# EAGLE design tick-ref-gps (EAGLE 6.2)
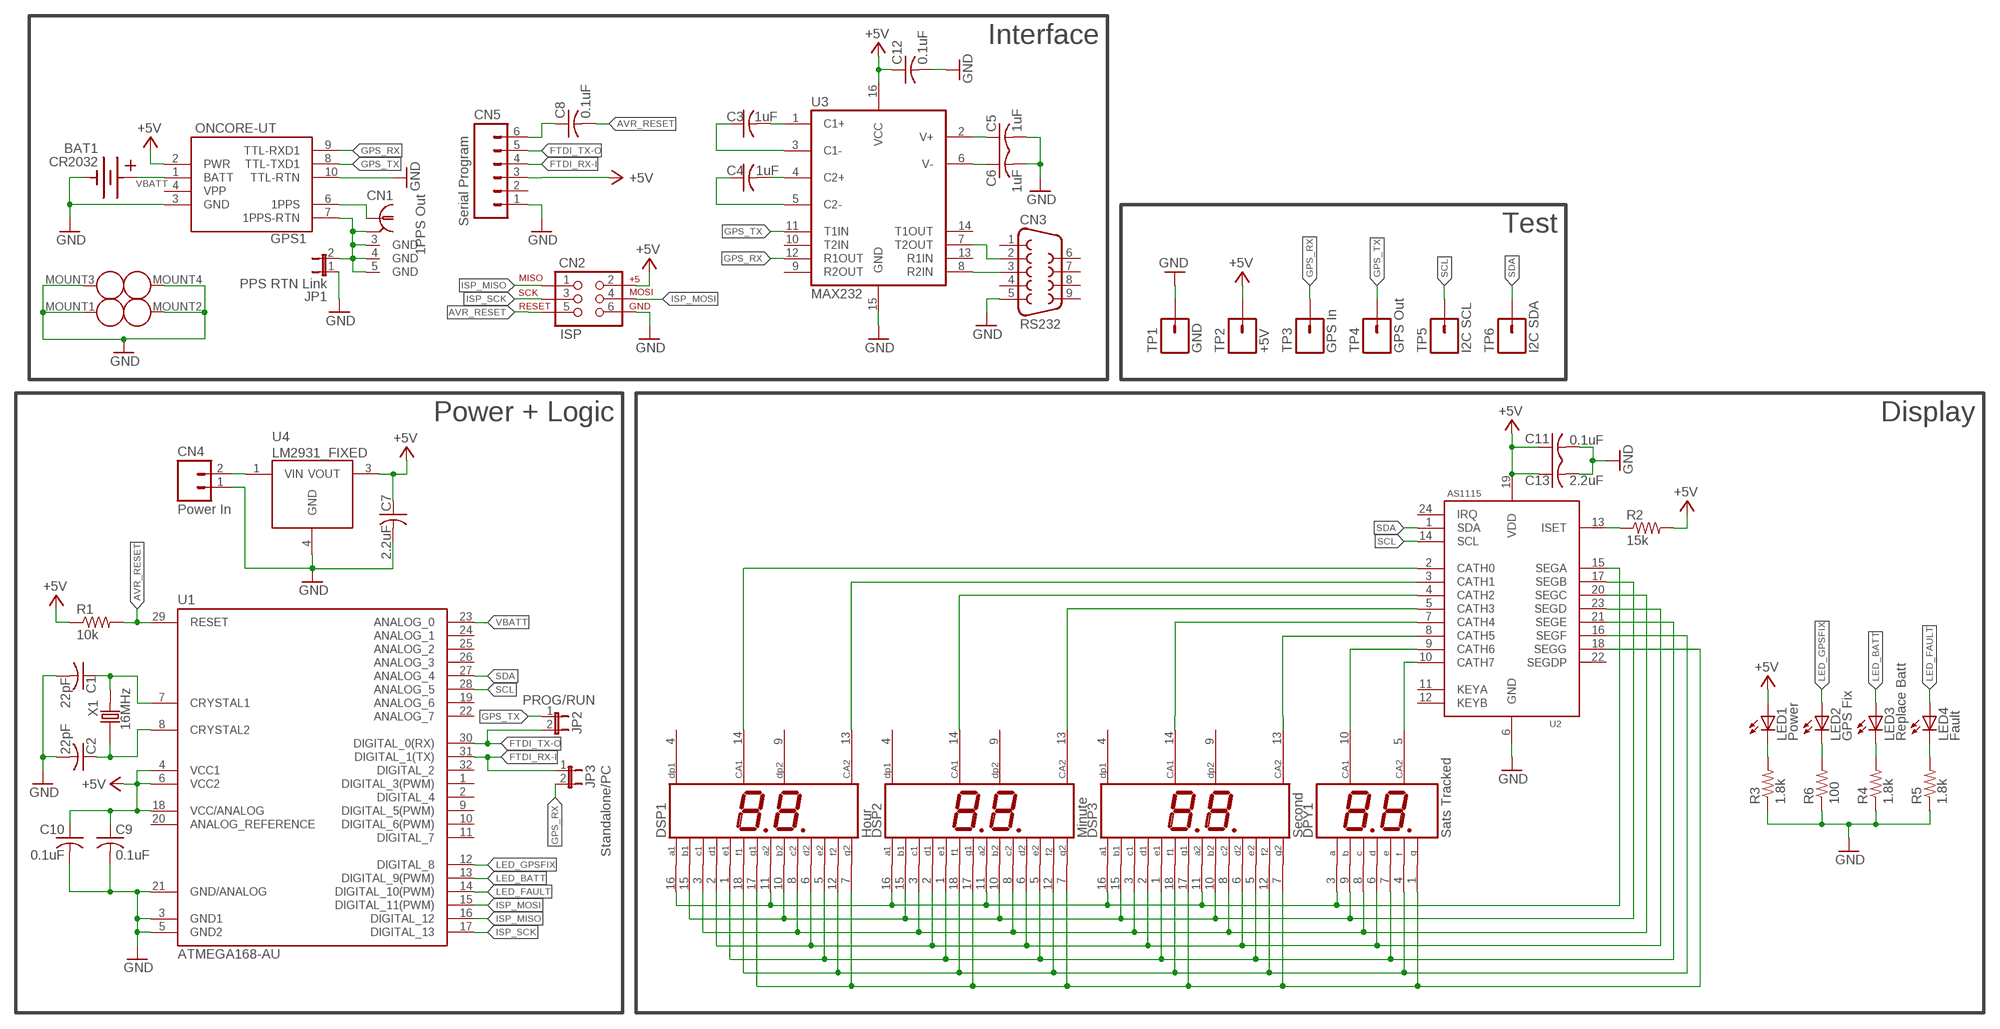
[diagram p0: schematic, sheet 1]

## Parts
BAT1  CR2032  [BK-912-CR2032]
C1  22pF  C-USC0603  [C0603]
C2  22pF  C-USC0603  [C0603]
C3  1uF  C-USC0603  [C0603]
C4  1uF  C-USC0603  [C0603]
C5  1uF  C-USC0603  [C0603]
C6  1uF  C-USC0603  [C0603]
C7  2.2uF  C-USC0805  [C0805]
C8  0.1uF  C-USC0603  [C0603]
C9  0.1uF  C-USC0603  [C0603]
C10  0.1uF  C-USC0603  [C0603]
C11  0.1uF  C-USC0603  [C0603]
C12  0.1uF  C-USC0603  [C0603]
C13  2.2uF  C-USC0805  [C0805]
CN1  1PPS Out  B35N57  [B35N57]
CN2  ISP  AVR_SPI_PRG_62X3_LOCK  [2X3_LOCK]
CN3  RS232  F09VP  [F09VP]
CN4  Power In  M02POLAR_LOCK  [MOLEX-1X2_LOCK]
CN5  Serial Program  M06LOCK  [1X06_LOCK]
DPY1  Sats Tracked  LUMEX-LDD-F302NI  [LDD-F302NI]
DSP1  Hour  HD-K121  [HDSP-R]
DSP2  Minute  HD-K121  [HDSP-R]
DSP3  Second  HD-K121  [HDSP-R]
GPS1  ONCORE-UT  [ONCORE-UT]
JP1  PPS RTN Link  JUMPER-2SMD-NO  [SJ_2S-NO]
JP2  PROG/RUN  JUMPER-2PTH_LOCK  [1X02_LOCK]
JP3  Standalone/PC  JUMPER-2SMD-NO  [SJ_2S-NO]
LED1  Power  LED5MM  [LED5MM]
LED2  GPS Fix  LED5MM  [LED5MM]
LED3  Replace Batt  LED5MM  [LED5MM]
LED4  Fault  LED5MM  [LED5MM]
R1  10k  R-US_R0603  [R0603]
R2  15k  R-US_R0603  [R0603]
R3  1.8k  R-US_R0603  [R0603]
R4  1.8k  R-US_R0603  [R0603]
R5  1.8k  R-US_R0603  [R0603]
R6  100  R-US_R0603  [R0603]
TP1  GND  M01PTH  [1X01]
TP2  +5V  M01PTH  [1X01]
TP3  GPS In  M01PTH  [1X01]
TP4  GPS Out  M01PTH  [1X01]
TP5  I2C SCL  M01PTH  [1X01]
TP6  I2C SDA  M01PTH  [1X01]
U1  ATMEGA168-AU  [TQFP32-08]
U2  AS1115  [QSOP24]
U3  MAX232  MAX232SOIC16  [SO016]
U4  LM2931_FIXED  [DPAK]
X1  16MHz  NX5032GA  [NX5032GA]

## Nets
1PPS: CN1.1 GPS1.6(1PPS)
1PPS_RTN: CN1.2(GND) CN1.3(GND) CN1.4(GND) CN1.5(GND) GPS1.7(1PPS-RTN) JP1.2
+5V: C7.1 C9.1 C10.1 C11.1 C12.1 C13.1 CN2.2 CN5.3 GPS1.2(PWR) LED1.A R1.1 R2.2 TP2.1 U1.4(VCC1) U1.6(VCC2) U1.18(VCC/ANALOG) U2.19(VDD) U3.16(VCC) U4.3(VOUT)
AVR_RESET: C8.2 CN2.5 R1.2 U1.29(RESET)
CATH_HOUR_LS: DSP1.13(CA2) U2.3(CATH1)
CATH_HOUR_MS: DSP1.14(CA1) U2.2(CATH0)
CATH_MIN_LS: DSP2.13(CA2) U2.5(CATH3)
CATH_MIN_MS: DSP2.14(CA1) U2.4(CATH2)
CATH_SATS_LS: DPY1.5(CA2) U2.10(CATH7)
CATH_SATS_MS: DPY1.10(CA1) U2.9(CATH6)
CATH_SEC_LS: DSP3.13(CA2) U2.8(CATH5)
CATH_SEC_MS: DSP3.14(CA1) U2.7(CATH4)
FTDI_RTS: C8.1 CN5.6
FTDI_RX-I: CN5.4 JP3.1 U1.31(DIGITAL_1(TX))
FTDI_TX-O: CN5.5 JP2.2 U1.30(DIGITAL_0(RX))
GND: BAT1.-(-1) C1.2 C2.2 C5.2 C6.2 C7.2 C9.2 C10.2 C11.2 C12.2 C13.2 CN2.6 CN3.5 CN4.1 CN5.1 GPS1.3(GND) GPS1.10(TTL-RTN) GPS1.MOUNT1(MOUNTHOLE1) GPS1.MOUNT2(MOUNTHOLE2) GPS1.MOUNT3(MOUNTHOLE3) GPS1.MOUNT4(MOUNTHOLE4) JP1.1 R3.1 R4.1 R5.1 R6.1 TP1.1 U1.3(GND1) U1.5(GND2) U1.21(GND/ANALOG) U2.6(GND) U3.15(GND) U4.4(GND)
GPS_RX: GPS1.9(TTL-RXD1) JP3.2 TP3.1 U3.12(R1OUT)
GPS_RX_HV: CN3.3 U3.8(R2IN)
GPS_TX: GPS1.8(TTL-TXD1) JP2.1 TP4.1 U3.11(T1IN)
GPS_TX_HV: CN3.2 U3.7(T2OUT)
ISP_MISO: CN2.1 U1.16(DIGITAL_12)
ISP_MOSI: CN2.4 U1.15(DIGITAL_11(PWM))
ISP_SCK: CN2.3 U1.17(DIGITAL_13)
LED1_R: LED1.K(C) R3.2
LED2_R: LED2.K(C) R6.2
LED3_R: LED3.K(C) R4.2
LED4_R: LED4.K(C) R5.2
LED_BATT: LED3.A U1.13(DIGITAL_9(PWM))
LED_FAULT: LED4.A U1.14(DIGITAL_10(PWM))
LED_GPSFIX: LED2.A U1.12(DIGITAL_8)
LED_ISET: R2.1 U2.13(ISET)
LED_SEG_A: DPY1.3(A) DSP1.11(A2) DSP1.16(A1) DSP2.11(A2) DSP2.16(A1) DSP3.11(A2) DSP3.16(A1) U2.15(SEGA)
LED_SEG_B: DPY1.9(B) DSP1.10(B2) DSP1.15(B1) DSP2.10(B2) DSP2.15(B1) DSP3.10(B2) DSP3.15(B1) U2.17(SEGB)
LED_SEG_C: DPY1.8(C) DSP1.3(C1) DSP1.8(C2) DSP2.3(C1) DSP2.8(C2) DSP3.3(C1) DSP3.8(C2) U2.20(SEGC)
LED_SEG_D: DPY1.6(D) DSP1.2(D1) DSP1.6(D2) DSP2.2(D1) DSP2.6(D2) DSP3.2(D1) DSP3.6(D2) U2.23(SEGD)
LED_SEG_E: DPY1.7(E) DSP1.1(E1) DSP1.5(E2) DSP2.1(E1) DSP2.5(E2) DSP3.1(E1) DSP3.5(E2) U2.21(SEGE)
LED_SEG_F: DPY1.4(F) DSP1.12(F2) DSP1.18(F1) DSP2.12(F2) DSP2.18(F1) DSP3.12(F2) DSP3.18(F1) U2.16(SEGF)
LED_SEG_G: DPY1.1(G) DSP1.7(G2) DSP1.17(G1) DSP2.7(G2) DSP2.17(G1) DSP3.7(G2) DSP3.17(G1) U2.18(SEGG)
MAX232-C1+: C3.2 U3.1(C1+)
MAX232-C1-: C3.1 U3.3(C1-)
MAX232-C2+: C4.2 U3.4(C2+)
MAX232-C2-: C4.1 U3.5(C2-)
MAX232-V+: C5.1 U3.2(V+)
MAX232-V-: C6.1 U3.6(V-)
SCL: TP5.1 U1.28(ANALOG_5) U2.14(SCL)
SDA: TP6.1 U1.27(ANALOG_4) U2.1(SDA)
VBATT: BAT1.+1(+2) GPS1.1(BATT) U1.23(ANALOG_0)
VIN: CN4.2 U4.1(VIN)
XTAL1: C1.1 U1.7(CRYSTAL1) X1.P$2
XTAL2: C2.1 U1.8(CRYSTAL2) X1.P$1
Unconnected: CN3.1 CN3.4 CN3.6 CN3.7 CN3.8 CN3.9 CN5.2 DSP1.4(DP1) DSP1.9(DP2) DSP2.4(DP1) DSP2.9(DP2) DSP3.4(DP1) DSP3.9(DP2) U1.1(DIGITAL_3(PWM)) U1.2(DIGITAL_4) U1.9(DIGITAL_5(PWM)) U1.10(DIGITAL_6(PWM)) U1.11(DIGITAL_7) U1.19(ANALOG_6) U1.20(ANALOG_REFERENCE) U1.22(ANALOG_7) U1.24(ANALOG_1) U1.25(ANALOG_2) U1.26(ANALOG_3) U1.32(DIGITAL_2) U2.11(KEYA) U2.12(KEYB) U2.22(SEGDP) U2.24(IRQ) U3.9(R2OUT) U3.10(T2IN) U3.13(R1IN) U3.14(T1OUT)

## Notes on the sheet
- Interface
- Test
- Power + Logic | Display

## Power pins joined to a net without a drawn wire
VPP: GPS1.4(VPP)

## Library data of the parts
BAT1 = con-sen:CR2032
C1-C13 = rcl:C-US: CAPACITOR, American symbol
CN1 = con-coax:B35N57: BNC CONNECTOR M/A COM www.macom.com
CN2 = SparkFun:AVR_SPI_PRG_6: AVR ISP 6 Pin This is the reduced ISP connector for AVR programming. Common on Arduino. This footprint will take up less PCB space and can be used with a 10-pin to 6-pin adapter such as SKU: BOB-08508
CN3 = con-subd:F09: SUB-D
CN4 = SparkFun:M02: Header 2 Standard 2-pin 0.1" header. Use with straight break away headers (SKU : PRT-00116), right angle break away headers (PRT-00553), swiss pins (PRT-00743), machine pins (PRT-00117), and female headers (PRT-00115). Molex polarized connector foot print use with SKU : PRT-08233 with associated crimp pins and housings.
CN5 = SparkFun:M06: Header 6 Standard 6-pin 0.1" header. Use with straight break away headers (SKU : PRT-00116), right angle break away headers (PRT-00553), swiss pins (PRT-00743), machine pins (PRT-00117), and female headers (PRT-00115). Molex polarized connector foot print use with SKU : PRT-08094 with associated crimp pins and housings. NOTES ON THE VARIANTS LOCK and LOCK_LONGPADS... This footprint was designed to help hold the alignment of a through-hole component (i.e. 6-pin header) while soldering it into place. You may notice that each hole has been shifted either up or down by 0.005 of an inch from it's more standard position (which is a perfectly straight line). This slight alteration caused the pins (the squares in the middle) to touch the edges of the holes. Because they are alternating, it causes a "brace" to hold the component in place. 0.005 has proven to be the perfect amount of "off-center" position when using our standard breakaway headers. Although looks a little odd when you look at the bare footprint, once you have a header in there, the alteration is very hard to notice. Also, if you push a header all the way into place, it is covered up entirely on the bottom side. This idea of altering the position of holes to aid alignment will be further integrated into the Sparkfun Library for other footprints. It can help hold any component with 3 or more connection pins.
DPY1 = led-sen:LUMEX-LDD-F302NI
DSP1-DSP3 = display-hp:HD-K121: LED DISPLAY 2 x 1 character 7 segment, decimal points right
GPS1 = motorola-sen:ONCORE-UT: Motorola OnCore UT timing GPS receiver
JP1-JP3 = SparkFun:JUMPER-2: Jumper Basic 0.1" spaced jumper. Use with breakaway headers.
LED1-LED4 = led:LED: LED OSRAM: - CHIPLED LG R971, LG N971, LY N971, LG Q971, LY Q971, LO R971, LY R971 LH N974, LH R974 LS Q976, LO Q976, LY Q976 LO Q996 - Hyper CHIPLED LW Q18S LB Q993, LB Q99A, LB R99A - SideLED LS A670, LO A670, LY A670, LG A670, LP A670 LB A673, LV A673, LT A673, LW A673 LH A674 LY A675 LS A676, LA A676, LO A676, LY A676, LW A676 LS A679, LY A679, LG A679 - Hyper Micro SIDELED® LS Y876, LA Y876, LO Y876, LY Y876 LT Y87S - SmartLED LW L88C, LW L88S LB L89C, LB L89S, LG L890 LS L89K, LO L89K, LY L89K LS L896, LA L896, LO L896, LY L896 - TOPLED LS T670, LO T670, LY T670, LG T670, LP T670 LSG T670, LSP T670, LSY T670, LOP T670, LYG T670 LG T671, LOG T671, LSG T671 LB T673, LV T673, LT T673, LW T673 LH T674 LS T676, LA T676, LO T676, LY T676, LB T676, LH T676, LSB T676, LW T676 LB T67C, LV T67C, LT T67C, LS T67K, LO T67K, LY T67K, LW E67C LS E67B, LA E67B, LO E67B, LY E67B, LB E67C, LV E67C, LT E67C LW T67C LS T679, LY T679, LG T679 LS T770, LO T770, LY T770, LG T770, LP T770 LB T773, LV T773, LT T773, LW T773 LH T774 LS E675, LA E675, LY E675, LS T675 LS T776, LA T776, LO T776, LY T776, LB T776 LHGB T686 LT T68C, LB T68C - Hyper Mini TOPLED® LB M676 - Mini TOPLED Santana® LG M470 LS M47K, LO M47K, LY M47K Source: http://www.osram.convergy.de LUXEON: - LUMILED® LXK2-PW12-R00, LXK2-PW12-S00, LXK2-PW14-U00, LXK2-PW14-V00 LXK2-PM12-R00, LXK2-PM12-S00, LXK2-PM14-U00 LXK2-PE12-Q00, LXK2-PE12-R00, LXK2-PE12-S00, LXK2-PE14-T00, LXK2-PE14-U00 LXK2-PB12-K00, LXK2-PB12-L00, LXK2-PB12-M00, LXK2-PB14-N00, LXK2-PB14-P00, LXK2-PB14-Q00 LXK2-PR12-L00, LXK2-PR12-M00, LXK2-PR14-Q00, LXK2-PR14-R00 LXK2-PD12-Q00, LXK2-PD12-R00, LXK2-PD12-S00 LXK2-PH12-R00, LXK2-PH12-S00 LXK2-PL12-P00, LXK2-PL12-Q00, LXK2-PL12-R00 Source: www.luxeon.com KINGBRIGHT: KA-3528ASYC Source: www.kingbright.com
R1-R6 = rcl:R-US_: RESISTOR, American symbol
TP1-TP6 = SparkFun:M01: Header 1 Standard 1-pin 0.1" header. Use with straight break away headers (SKU : PRT-00116), right angle break away headers (PRT-00553), swiss pins (PRT-00743), machine pins (PRT-00117), and female headers (PRT-00115).
U1 = Arduino-AVR:ATMEGA168
U2 = austria-sen:AS1115: austriamicrosystems AS1115 64-channel I2C LED driver. Drives 8x8 matrix or 8x 7-segment displays
U3 = SparkFun-DigitalIC:MAX232: RS232 Transceiver Very common IC. This is generically called 'MAX232', but works with the 3V equivalent MAX3232 generic ICs. Field tested and mother approved. Spark Fun Electronics SKU : COM-00316 (DIP) and COM-00589 (SMD)
U4 = SparkFun-PowerIC:LM2931_FIXED: LDO regulator with reverse battery protection- very durable!
X1 = crystal-sen:NX5032GA

## Board
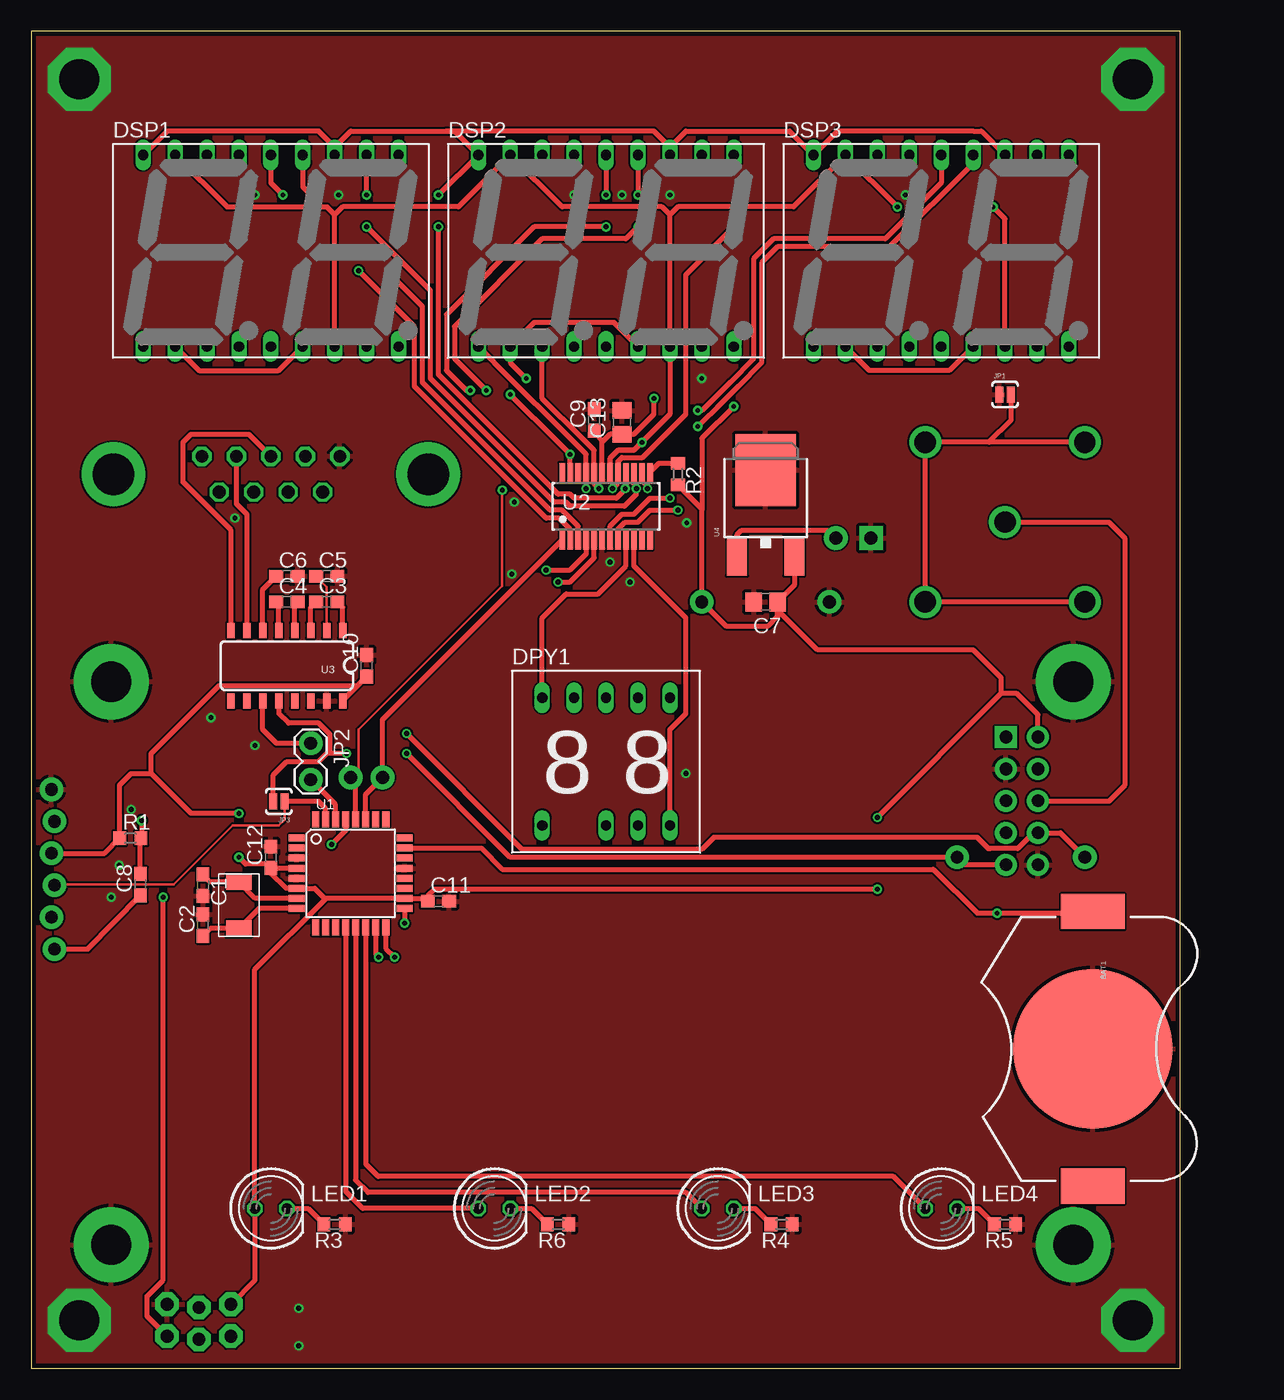
[diagram p1: board, top side]
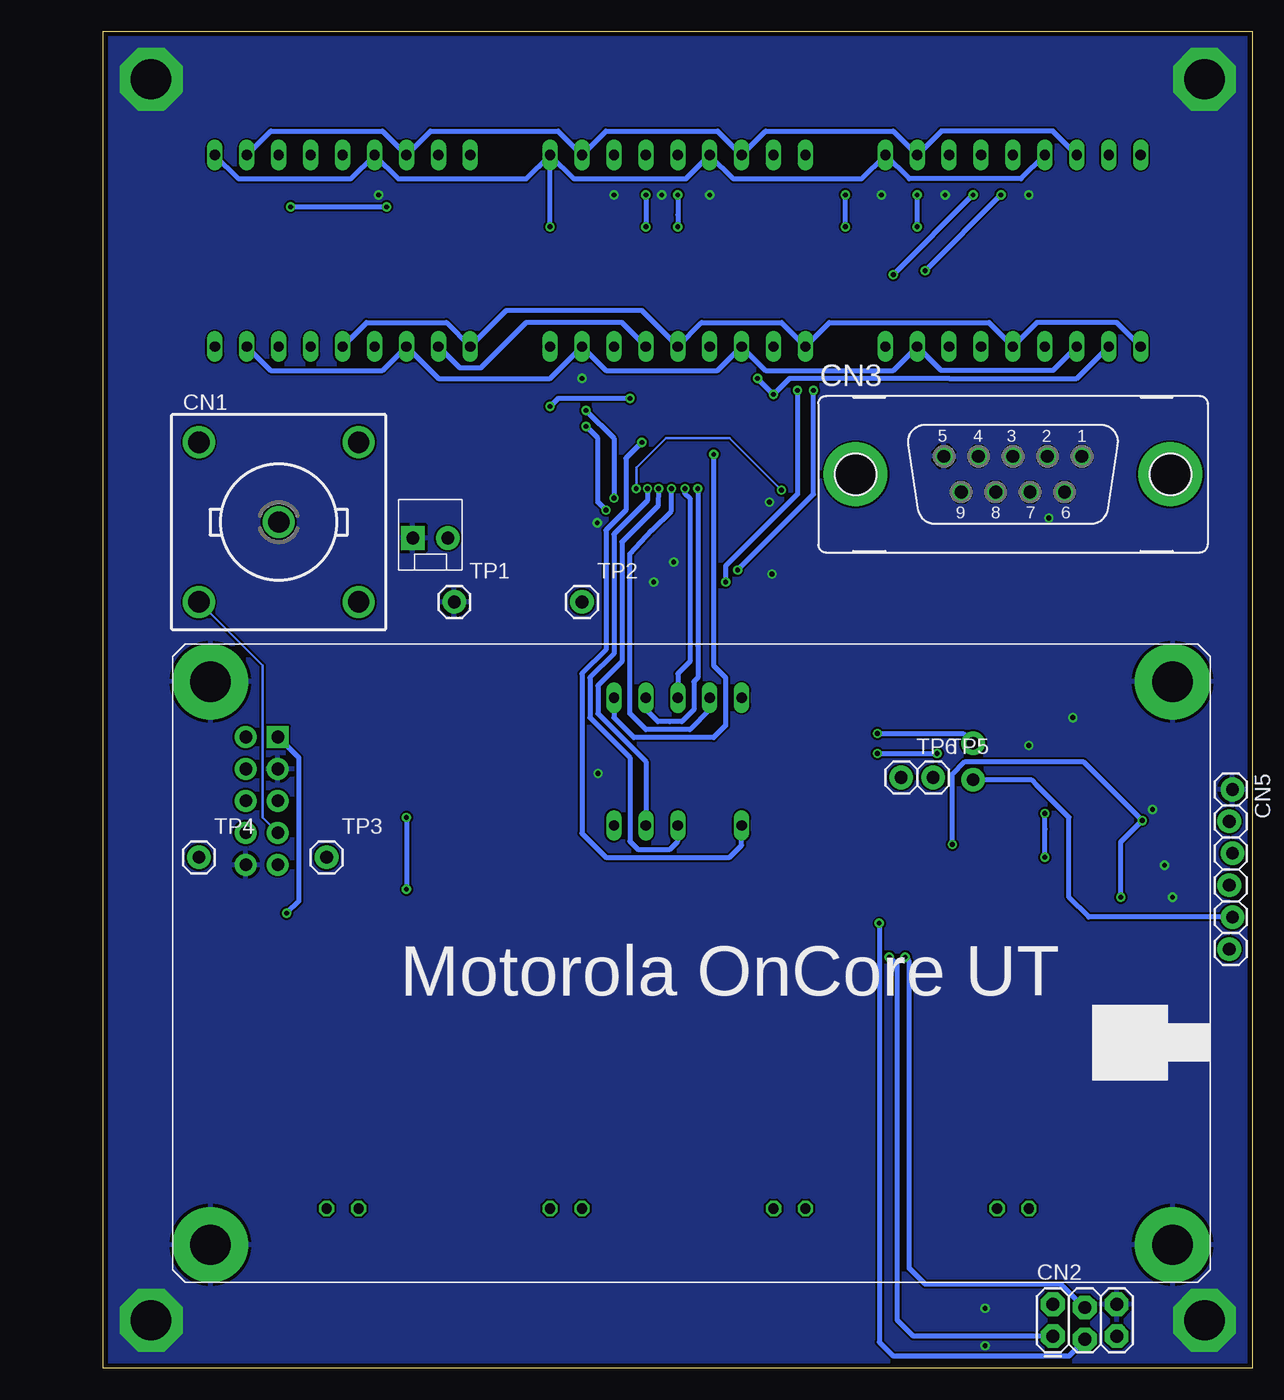
[diagram p2: board, bottom side, seen from below]

Size 91.42 x 106.35 mm. Coordinates in mm from the lower left corner, seen from the top.
Outline: 0,0 91.42,0 91.42,106.35 0,106.35 0,0
Copper layers (1*16): Top 0.0356mm / dielectric 1.5011mm / Bottom 0.0356mm
Design rules: minimum track width 6mil, minimum drill 13mil, track to track 6mil, track to pad 6mil, pad to pad 6mil, via to via 6mil, smd to smd 6mil, copper to edge 15mil, drill to drill 6mil, minimum pad ring 7mil, minimum via ring 7mil, stop-mask expansion 4mil, vias tented up to drill 0mil, thermal gap 10mil

### Footprints (pad centres in the part's own frame; a part is rotated, then mirrored left to right if it is on the bottom)
BK-912-CR2032 = smd 2.794 x 5.08: +1 -10.922,0; +2 10.922,0 | smd 12.7 x 12.7: - 0,0
C0603 = smd 1.1 x 1: 1 -0.85,0; 2 0.85,0
C0805 = smd 1.3 x 1.5: 1 -0.95,0; 2 0.95,0
B35N57 = drill 1.7: 1 0,0; 2 6.35,6.35; 3 -6.35,6.35; 4 -6.35,-6.35; 5 6.35,-6.35
2X3_LOCK = drill 1.016 pad 1.88 octagon: 1 0,0; 2 0,2.54; 3 2.54,-0.254; 4 2.54,2.286; 5 5.08,0; 6 5.08,2.54
F09VP = drill 1.016 octagon: 1 5.486,1.422; 2 2.743,1.422; 3 0,1.422; 4 -2.743,1.422; 5 -5.486,1.422; 6 4.115,-1.422; 7 1.372,-1.422; 8 -1.372,-1.422; 9 -4.115,-1.422 | drill 3.302 pad 5.08: G1 -12.522,0; G2 12.522,0
MOLEX-1X2_LOCK = drill 1.016 pad 1.88 square: 1 -0.127,0 | drill 1.016 pad 1.88: 2 2.667,0
1X06_LOCK = drill 1.016 pad 1.88: 1 0,0; 2 2.54,-0.254; 3 5.08,0; 4 7.62,-0.254; 5 10.16,0; 6 12.7,-0.254
LDD-F302NI = drill 0.813 long: 1 -5.08,-5.08; 3 0,-5.08; 4 2.54,-5.08; 5 5.08,-5.08; 6 5.08,5.08; 7 2.54,5.08; 8 0,5.08; 9 -2.54,5.08; 10 -5.08,5.08
HDSP-R = drill 0.813 long: 1 -10.16,-7.62; 2 -7.62,-7.62; 3 -5.08,-7.62; 4 -2.54,-7.62; 5 0,-7.62; 6 2.54,-7.62; 7 5.08,-7.62; 8 7.62,-7.62; 9 10.16,-7.62; 10 10.16,7.62; 11 7.62,7.62; 12 5.08,7.62; 13 2.54,7.62; 14 0,7.62; 15 -2.54,7.62; 16 -5.08,7.62; 17 -7.62,7.62; 18 -10.16,7.62
ONCORE-UT = drill 1 pad 1.75 square: 1 71.2,4.4 | drill 1 pad 1.75: 2 73.74,4.4; 3 71.2,6.94; 4 73.74,6.94; 5 71.2,9.48; 6 73.74,9.48; 7 71.2,12.02; 8 73.74,12.02; 9 71.2,14.56; 10 73.74,14.56 | drill 3.2 pad 6: MOUNT1 0,0; MOUNT2 76.55,0; MOUNT3 0,44.8; MOUNT4 76.55,44.8
SJ_2S-NO = smd 0.635 x 1.27: 1 -0.45,0; 2 0.45,0
1X02_LOCK = drill 1.016 pad 1.88: 1 -0.178,0; 2 2.718,0
LED5MM = drill 0.813 octagon: A -1.27,0; K 1.27,0
R0603 = smd 1 x 1.1: 1 -0.85,0; 2 0.85,0
1X01 = drill 1.016 pad 1.88: 1 0,0
TQFP32-08 = smd 1.27 x 0.559: 1 -4.293,2.8; 2 -4.293,2; 3 -4.293,1.2; 4 -4.293,0.4; 5 -4.293,-0.4; 6 -4.293,-1.2; 7 -4.293,-2; 8 -4.293,-2.8; 17 4.293,-2.8; 18 4.293,-2; 19 4.293,-1.2; 20 4.293,-0.4; 21 4.293,0.4; 22 4.293,1.2; 23 4.293,2; 24 4.293,2.8 | smd 0.559 x 1.27: 9 -2.8,-4.293; 10 -2,-4.293; 11 -1.2,-4.293; 12 -0.4,-4.293; 13 0.4,-4.293; 14 1.2,-4.293; 15 2,-4.293; 16 2.8,-4.293; 25 2.8,4.293; 26 2,4.293; 27 1.2,4.293; 28 0.4,4.293; 29 -0.4,4.293; 30 -1.2,4.293; 31 -2,4.293; 32 -2.8,4.293
QSOP24 = smd 0.45 x 1.5: 1 -3.493,-2.69; 2 -2.857,-2.69; 3 -2.223,-2.69; 4 -1.587,-2.69; 5 -0.953,-2.69; 6 -0.318,-2.69; 7 0.318,-2.69; 8 0.953,-2.69; 9 1.587,-2.69; 10 2.223,-2.69; 11 2.857,-2.69; 12 3.493,-2.69; 13 3.493,2.69; 14 2.857,2.69; 15 2.223,2.69; 16 1.587,2.69; 17 0.953,2.69; 18 0.318,2.69; 19 -0.318,2.69; 20 -0.953,2.69; 21 -1.587,2.69; 22 -2.223,2.69; 23 -2.857,2.69; 24 -3.493,2.69
SO016 = smd 0.6 x 1.2: 1 -4.445,-2.8; 2 -3.175,-2.8; 3 -1.905,-2.8; 4 -0.635,-2.8; 5 0.635,-2.8; 6 1.905,-2.8; 7 3.175,-2.8; 8 4.445,-2.8; 9 4.445,2.8; 10 3.175,2.8; 11 1.905,2.8; 12 0.635,2.8; 13 -0.635,2.8; 14 -1.905,2.8; 15 -3.175,2.8; 16 -4.445,2.8
DPAK = smd 1.6 x 3: 1 -2.28,-5.31; 3 2.28,-5.31 | smd 4.826 x 5.715: 4 0,1.588
NX5032GA = smd 1.3 x 2: P$1 -1.85,0; P$2 1.85,0

### Placement (x,y rotation side)
BAT1  84.45,25.4 270 top
C1  13.65,38.42 270 top
C2  13.65,35.24 90 top
C3  23.5,60.96 0 top
C4  20.32,60.96 0 top
C5  23.5,63 0 top
C6  20.32,63 0 top
C7  58.42,60.96 180 top
C8  8.67,38.47 90 top
C9  44.77,75.44 90 top
C10  26.67,55.88 90 top
C11  32.38,37.15 0 top
C12  19.05,40.64 90 top
C13  46.99,75.25 90 top
CN1  77.47,67.31 0 bottom
CN2  15.88,2.54 0 bottom
CN3  19.05,71.12 0 bottom
CN4  66.67,66.04 0 bottom
CN5  1.59,46.04 270 bottom
DPY1  45.72,48.26 0 top
DSP1  19.05,88.9 0 top
DSP2  45.72,88.9 0 top
DSP3  72.39,88.9 0 top
GPS1  6.35,54.61 180 bottom
JP1  77.47,77.47 0 top
JP2  22.23,49.53 270 top
JP3  19.68,45.09 180 top
LED1  19.05,12.7 0 top
LED2  36.83,12.7 0 top
LED3  54.61,12.7 0 top
LED4  72.39,12.7 0 top
R1  7.87,42.16 0 top
R2  51.44,71.12 270 top
R3  24.13,11.43 180 top
R4  59.69,11.43 180 top
R5  77.47,11.43 180 top
R6  41.91,11.43 180 top
TP1  63.5,60.96 0 bottom
TP2  53.34,60.96 0 bottom
TP3  73.66,40.64 0 bottom
TP4  83.82,40.64 0 bottom
TP5  25.4,46.99 0 bottom
TP6  27.94,46.99 0 bottom
U1  25.4,39.37 0 top
U2  45.72,68.58 0 top
U3  20.32,55.88 180 top
U4  58.42,69.85 0 top
X1  16.51,36.83 90 top

### Tracks (layer width: path | path; a pad name or v marks a point on that pad's centre or on a via)
1PPS
  Top 0.406: CN1.1 85.72,67.31 87,66.04 87,46.35 85.72,45.09 80.14,45.09 GPS1.6
1PPS_RTN
  Top 0.406: JP1.2 77.92,75.38 76.2,73.66 71.75,73.66 | 71.75,73.66 CN1.2 CN1.5 CN1.4 | CN1.3 71.75,73.66
  Bottom 0.203: GPS1.7 77.55,42.62 78.74,43.81 78.74,55.88 CN1.4
+5V  (via drill 0.38)
  Top 0.406: U4.3 60.7,62.29 C7.1 59.37,60.33 | 59.37,60.33 59.37,59.79 58.64,59.05 55.24,59.05 54.61,59.69 TP2.1 53.34,68.26 | U3.16 24.77,53.12 C10.1 25.93,54.29 14.92,54.29 9.53,48.9 9.53,47.31 | U1.4 21.09,39.79 C12.1 19.05,40.11 | 19.05,40.11 19.05,39.37 20.25,38.17 U1.6 22.54,38.17 22.61,38.1 23.34,37.37 23.43,37.37 | GPS1.2 80.09,51.99 78.42,53.66 77.15,53.66 | 59.37,60.33 62.55,57.15 74.93,57.15 77.15,54.93 77.15,53.66 | 23.43,37.37 U1.18 31.31,37.37 C11.1 31.54,37.57 32.07,38.1 v67.31,38.1 | 23.43,37.37 17.78,31.72 LED1.A 17.78,6.99 CN2.2 | U2.19 45.4,73.66 | 45.4,73.66 45.4,73.76 C9.1 | 45.4,73.66 46.04,74.3 C13.1 47.95,74.3 49.53,75.88 v49.53,77.15 | 53.34,68.26 53.34,68.36 R2.2 | CN5.3 5.82,40.96 R1.1 7.02,46.39 7.62,46.99 7.94,47.31 9.53,47.31 | 19.05,40.11 17.04,40.11 v16.51,40.64 | v16.51,44.13 12.7,44.13 9.53,47.31 | v55.88,76.52 53.34,73.98 53.34,68.26 | 77.15,53.66 v67.31,43.81
  Bottom 0.406: v16.51,40.64 16.51,42.86 v16.51,44.13 | v49.53,77.15 55.24,77.15 v55.88,76.52 | v67.31,43.81 v67.31,38.1
AVR_RESET  (via drill 0.38)
  Top 0.406: C8.2 8.67,42.11 R1.2 8.76,42.2 v8.76,43.56 | U1.29 25,42.78 v23.88,41.66 | CN2.5 9.53,3.81 9.21,4.13 9.21,5.71 10.48,6.99 v10.48,37.47
  Bottom 0.406: v23.88,41.66 23.88,45.09 23.88,45.59 23.88,47.24 22.86,48.26 13.46,48.26 v8.76,43.56 10.48,41.85 v10.48,37.47
CATH_HOUR_LS  (via drill 0.38)
  Top 0.406: U2.3 43.5,66.99 42.23,68.26 41.27,68.26 31.11,78.42 31.11,84.45 29.84,85.72 v28.57,87 | DSP1.13 21.59,93.98 v22.23,93.34
  Bottom 0.406: v22.23,93.34 v28.57,87
CATH_HOUR_MS  (via drill 0.38)
  Top 0.406: U2.2 42.86,66.74 41.97,67.63 40.96,67.63 30.48,78.11 30.48,79.06 30.48,82.87 28.89,84.45 26.67,86.68 v26.04,87.31 | DSP1.14 19.05,94.3 v20,93.34
  Bottom 0.406: v20,93.34 v26.04,87.31
CATH_MIN_LS  (via drill 0.38)
  Top 0.406: DSP2.13 v48.26,93.34 | v48.26,90.81 47.31,89.85 40.64,89.85 33.66,82.87 33.66,80.33 v36.2,77.79 | v41.91,62.55 42.86,62.55 44.77,64.45 U2.5
  Bottom 0.406: v48.26,93.34 v48.26,90.81 | v36.2,77.79 36.2,69.53 41.91,63.82 41.91,63.18 v41.91,62.55
CATH_MIN_MS  (via drill 0.38)
  Top 0.406: DSP2.14 v45.72,93.34 | v45.72,90.81 40.01,90.81 33.02,83.82 33.02,79.38 34.13,78.26 | 34.13,78.26 34.61,77.79 | 34.61,77.79 v34.92,77.79 34.61,77.79 | U2.4 44.13,64.77 42.86,63.5 v40.96,63.5 | 34.61,77.79 34.13,78.26
  Bottom 0.406: v45.72,93.34 45.72,91.76 v45.72,90.81 | v34.92,77.79 34.92,69.53 v40.96,63.5
CATH_SATS_LS
  Top 0.406: DPY1.5 50.8,50.8 51.75,51.75 52.07,52.07 52.07,59.69 47.94,63.82 U2.10
CATH_SATS_MS
  Top 0.406: DPY1.10 40.64,59.69 42.55,61.59 45.09,61.59 47.31,63.82 U2.9
CATH_SEC_LS  (via drill 0.38)
  Top 0.406: DSP3.13 74.93,95.89 68.26,89.22 59.37,89.22 58.1,87.95 58.1,80.01 56.2,78.11 54.93,76.83 | 54.93,76.83 54.61,76.52 | U2.8 46.67,66.74 47.24,67.31 48.26,67.31 49.21,68.26 v51.44,68.26 | v53.02,74.93 54.93,76.83
  Bottom 0.406: v51.44,68.26 52.07,68.9 52.07,73.98 v53.02,74.93
CATH_SEC_MS  (via drill 0.38)
  Top 0.406: DSP3.14 72.39,94.3 67.94,89.85 59.05,89.85 57.78,88.58 57.47,88.27 57.47,80.33 55.56,78.42 53.34,76.2 v53.02,76.2 | U2.7 46.04,66.99 46.99,67.94 47.94,67.94 49.21,69.22 50.48,69.22 | 50.48,69.22 v50.8,69.22 50.48,69.22
  Bottom 0.406: v53.02,76.2 50.8,73.98 v50.8,69.22
FTDI_RTS
  Top 0.406: CN5.6 4.5,33.34 C8.1
FTDI_RX-I
  Top 0.203: JP3.1 20.14,43.63 19.68,43.18 16,43.18 11.3,38.48 1.91,38.48
  Top 0.406: U1.31 23.4,44.55 22.86,45.09 20.77,45.09 JP3.1 | 1.91,38.48 CN5.4
FTDI_TX-O
  Top 0.406: U1.30 24.2,44.84 JP2.2
  Bottom 0.406: CN5.5 13.02,35.88 14.61,37.47 14.61,43.81 17.14,46.35 17.6,46.81 JP2.2
GND  (via drill 0.38, 3.2 pad 5)
  other vias: 87.63,3.81 87.63,102.55 3.81,102.55 3.81,3.81 14.29,51.75 17.78,49.53 7.94,44.45 6.99,40.01 6.35,37.47 53.34,78.74 52.13,67.25 46.04,64.14 47.62,62.55 38.23,63.18 38.42,68.9 52.07,47.31 21.27,4.76 21.27,1.78 24.45,93.34 29.53,93.34 17.78,93.34 50.8,93.34 43.18,93.34 69.53,93.34 46.99,93.34 16.19,67.63
  pour Top: 0,106.68 91.44,106.68 91.44,0 0,0
  pour Bottom: 0,106.68 91.44,106.68 91.44,0 0,0
GPS_RX  (via drill 0.38)
  Top 0.406: GPS1.9 74.25,40.05 TP3.1 38.1,40.64 v29.84,48.9 | JP3.2 19.23,47.17 20.32,48.26 22.86,48.26 23.18,48.58 | U3.12 19.68,52.07 20.45,51.31 22.86,51.31 23.75,50.42 23.75,49.15 23.5,48.9 | 23.18,48.58 23.5,48.9 | v25.08,48.9 23.5,48.9 | 23.5,48.9 23.18,48.58
  Bottom 0.406: v29.84,48.9 v25.08,48.9
GPS_RX_HV
  Top 0.406: U3.8 15.88,66.67 13.34,69.22 12.06,70.48 12.06,73.66 12.7,74.3 17.3,74.3 CN3.3
GPS_TX  (via drill 0.38)
  Top 0.406: TP4.1 81.87,42.59 GPS1.8 79.74,42.59 78.49,41.34 76.26,41.34 76.14,41.34 75.25,42.23 54.29,42.23 53.34,41.27 39.05,41.27 v29.84,50.48 | JP2.1 19.51,49.71 18.41,50.8 U3.11
  Bottom 0.406: v29.84,50.48 23,50.48 JP2.1
GPS_TX_HV
  Top 0.406: CN3.2 16.31,68.78 17.14,67.94 U3.7
ISP_MISO  (via drill 0.38)
  Top 0.406: U1.16 28.2,33.4 v28.89,32.7
  Bottom 0.406: CN2.1 26.99,2.54 28.26,3.81 28.26,32.07 v28.89,32.7
ISP_MOSI  (via drill 0.38)
  Top 0.406: U1.15 27.4,32.92 v27.62,32.7
  Bottom 0.406: CN2.4 13.4,4.83 15.24,6.67 26.04,6.67 27.3,7.94 27.3,31.43 27.3,32.38 v27.62,32.7
ISP_SCK  (via drill 0.38)
  Top 0.406: U1.17 v29.69,35.4
  Bottom 0.406: CN2.3 13.34,2.22 14.61,0.95 28.57,0.95 29.21,1.59 29.69,2.07 v29.69,35.4
LED1_R
  Top 0.406: LED1.K 22.01,12.7 R3.2
LED2_R
  Top 0.406: LED2.K 39.79,12.7 R6.2
LED3_R
  Top 0.406: LED3.K 57.57,12.7 R4.2
LED4_R
  Top 0.406: LED4.K 75.35,12.7 R5.2
LED_BATT
  Top 0.406: LED3.A 52.07,13.97 26.77,13.97 25.79,14.95 25.8,14.95 U1.13
LED_FAULT
  Top 0.406: LED4.A 69.22,14.61 68.58,15.24 27.6,15.24 27.13,15.7 | 27.13,15.7 26.63,16.2 | U1.14 26.6,16.24 27.13,15.7
LED_GPSFIX
  Top 0.406: LED2.A 26.35,12.7 25.08,13.97 25,14.05 U1.12
LED_ISET
  Top 0.406: R2.1 49.91,71.97 U2.13
LED_SEG_A  (via drill 0.38)
  Top 0.406: 48.13,69.53 47.18,68.58 | 47.18,68.58 42.86,68.58 42.55,68.9 41.59,68.9 31.75,78.74 31.75,85.72 v26.67,90.81 | v26.67,93.34 DSP1.11 | 47.18,68.58 48.13,69.53 | 48.13,69.53 v48.13,69.98 48.13,70.17 48.07,70.23 47.94,70.36 47.94,70.55 U2.15
  Bottom 0.406: DSP1.16 15.88,98.42 24.77,98.42 DSP1.11 28.57,98.42 38.73,98.42 DSP2.16 42.55,98.42 51.44,98.42 DSP2.11 55.24,98.42 65.41,98.42 DSP3.16 69.22,98.42 78.11,98.42 DSP3.11 | v26.67,90.81 v26.67,93.34 | v48.13,69.98 48.13,69.03 50.8,66.36 50.8,56.83 52.7,54.93 52.7,51.75 49.53,48.58 49.53,41.91 48.9,41.27 46.35,41.27 45.72,41.91 DPY1.3
LED_SEG_B  (via drill 0.38)
  Top 0.406: v55.88,90.81 52.07,87 52.07,75.88 50.16,73.98 48.64,72.45 46.99,72.45 46.67,72.14 U2.17 46.67,70.42 v46.23,69.98
  Bottom 0.406: DSP1.15 18.41,94.61 27.3,94.61 DSP1.10 31.11,94.61 41.27,94.61 DSP2.15 45.09,94.61 53.98,94.61 DSP2.10 | DSP2.10 57.78,94.61 67.94,94.61 DSP3.15 71.75,94.61 80.64,94.61 DSP3.10 | v55.88,90.81 DSP2.10 | DPY1.9 43.18,52.39 44.77,50.8 48.26,50.8 49.53,52.07 49.53,64.77 47.75,66.67 46.23,68.2 v46.23,69.98 46.35,69.85
LED_SEG_C  (via drill 0.38)
  Top 0.406: DSP2.3 40.64,77.15 43.81,73.98 44.77,73.03 U2.20 44.77,70.36 v45.15,69.98
  Bottom 0.406: DSP1.3 15.88,79.38 24.77,79.38 DSP1.8 28.57,79.38 38.73,79.38 DSP2.3 42.55,79.38 51.44,79.38 DSP2.8 55.88,78.74 64.77,78.74 DSP3.3 69.22,79.38 78.11,79.38 DSP3.8 | v45.15,69.98 45.15,69.6 44.77,69.22 44.77,56.2 45.72,55.24 DPY1.8
LED_SEG_D  (via drill 0.38)
  Top 0.406: v42.86,72.71 U2.23 v42.86,72.71 | v42.86,72.71 41.91,73.66 v38.1,77.47 | DSP1.2 13.34,79.38 19.68,79.38 DSP1.6 | DSP3.6 73.03,79.38 66.67,79.38 DSP3.2 | DSP2.6 46.35,83.19 40.01,83.19 DSP2.2 38.1,80.01 v39.37,78.74
  Bottom 0.406: v39.37,78.74 v38.1,77.47 36.83,78.74 24.13,78.74 13.97,78.74 DSP1.2 | DSP2.6 50.16,83.19 57.78,83.19 60.64,80.33 61.4,79.57 63.06,79.57 DSP3.2 | v42.86,72.71 42.86,55.88 41.91,54.93 41.91,51.12 42.86,50.16 49.21,50.16 50.16,51.12 | 50.16,51.12 50.48,51.44 | DPY1.6 50.8,51.75 50.16,51.12
LED_SEG_E  (via drill 0.38)
  Top 0.406: DSP2.1 38.1,78.74 42.23,74.61 43.18,73.66 44.13,72.71 U2.21 v44.13,69.98
  Bottom 0.406: DSP1.1 10.79,83.19 17.14,83.19 DSP1.5 20.95,83.19 33.66,83.19 DSP2.1 37.47,83.19 43.81,83.19 DSP2.5 48.58,84.14 59.37,84.14 DSP3.1 64.14,83.19 70.48,83.19 DSP3.5 | v44.13,69.98 44.13,57.47 44.13,54.93 44.45,54.61 44.45,52.39 45.4,51.44 46.35,51.44 47.31,51.44 48.26,52.39 DPY1.7
LED_SEG_F  (via drill 0.38)
  Top 0.406: DSP1.18 10.79,98.42 22.86,98.42 24.13,97.16 | 33.02,98.42 25.4,98.42 24.13,97.16 | 33.02,98.42 33.66,98.42 DSP2.18 v32.38,93.34 | DSP1.12 24.13,97.16 | 50.8,97.16 DSP2.12 50.8,97.16 | 50.8,97.16 49.53,98.42 33.02,98.42 | 50.8,97.16 52.07,98.42 60.33,98.42 DSP3.18 64.14,98.42 74.93,98.42 75.56,98.42 DSP3.12 | v32.38,90.81 32.38,79.06 41.91,69.53 42.86,69.53 43.18,69.22 46.55,69.22 47.24,69.91 v47.24,69.98 47.31,70.04 U2.16
  Bottom 0.406: v32.38,90.81 v32.38,93.34 | v47.24,69.98 47.31,68.58 49.85,66.04 50.16,65.72 50.16,56.2 52.07,54.29 52.07,52.07 49.21,49.21 48.26,48.26 DPY1.4
LED_SEG_G  (via drill 0.38)
  Top 0.406: DSP1.17 15.56,92.39 22.86,92.39 23.5,92.39 24.13,91.76 | DSP1.7 24.13,91.76 | 24.13,91.76 24.77,92.39 33.97,92.39 DSP2.17 42.23,92.39 50.16,92.39 50.8,91.76 | 50.8,91.76 DSP2.7 50.8,75.88 v48.58,73.66 | 50.8,91.76 51.44,92.39 60.64,92.39 DSP3.17 v68.9,92.39 | DSP3.7 77.47,91.44 v76.52,92.39 | v48.58,73.66 47.94,73.03 | 47.94,73.03 46.67,73.03 | 46.67,73.03 46.04,72.39 | 46.04,72.39 U2.18 46.04,72.39 | 46.04,72.39 46.67,73.03 | 46.67,73.03 47.94,73.03 | 47.94,73.03 v48.58,73.66
  Bottom 0.406: v76.52,92.39 v68.9,92.39 | v48.58,73.66 49.85,72.39 49.85,68.26 51.44,66.67 51.44,57.15 53.34,55.24 53.34,42.55 51.44,40.64 41.59,40.64 40.64,41.59 DPY1.1
MAX232-C1+
  Top 0.406: U3.1 24.77,60.54 C3.2
MAX232-C1-
  Top 0.406: U3.3 22.23,60.54 C3.1
MAX232-C2+
  Top 0.406: U3.4 20.95,60.74 C4.2
MAX232-C2-
  Top 0.406: U3.5 19.68,60.74 C4.1
MAX232-V+
  Top 0.203: U3.2 23.5,62.16 C5.1
MAX232-V-
  Top 0.406: U3.6 18.41,61.95 C6.1
SCL  (via drill 0.38)
  Top 0.203: U2.14 48.58,70.42 v49.02,69.98 | v37.47,69.85 37.47,62.23 26.04,50.8 26.04,47.62 TP5.1
  Top 0.406: U1.28 25.8,46.59 TP5.1
  Bottom 0.203: v49.02,69.98 49.02,71.63 46.67,73.98 41.59,73.98 v37.47,69.85
SDA
  Top 0.406: U1.27 26.6,45.65 TP6.1 27.94,51.6 U2.1
VBATT  (via drill 0.38)
  Top 0.406: BAT1.+1 84.33,36.2 v76.83,36.2 75.25,36.2 71.75,39.69 37.47,39.69 35.78,41.37 U1.23
  Bottom 0.406: GPS1.1 77.52,50.21 75.88,48.58 75.88,37.15 v76.83,36.2
VIN
  Top 0.406: U4.1 56.14,66.3 56.52,66.67 63.37,66.67 CN4.2
XTAL1
  Top 0.406: U1.7 17.82,37.37 X1.P$2 14.24,38.68 C1.1
XTAL2
  Top 0.406: U1.8 18.1,36.57 X1.P$1 14.24,34.98 C2.1